# Altium schematic sheet SCH_WifiNode.SchDoc: TP Final - Reloj - WifiNode
size A4; Author: Luciano Lopez; CompanyName: UTN-FRBA; Revision: 1; SheetNumber: 9; SheetTotal: 10
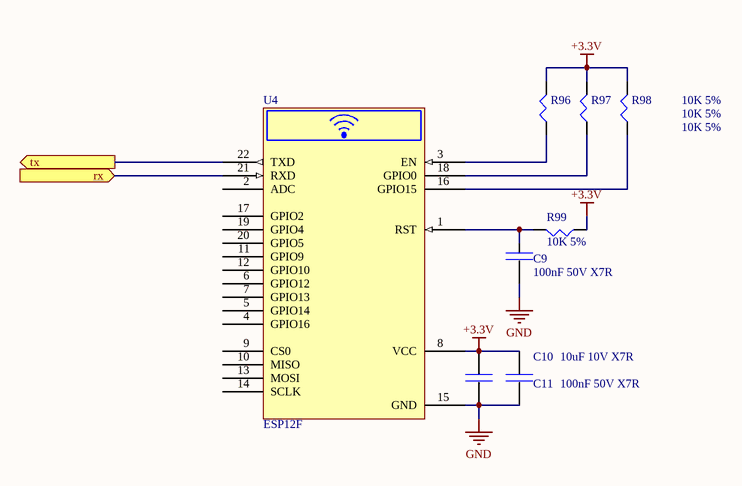
[diagram p0: SCH_WifiNode.SchDoc]

## Parts
C9  100nF 50V X7R  [C_0805]
C10  10uF 10V X7R  [C_0805]
C11  100nF 50V X7R  [C_0805]
R96  10K 5%  [R_0805]
R97  10K 5%  [R_0805]
R98  10K 5%  [R_0805]
R99  10K 5%  [R_0805]
U4  ESP12F  [ESP12F]

## Ports
rx (in), tx (out)

## Nets
+3.3V: C10.2 C11.2 R96.2 R97.2 R98.2 R99.1 U4.8(VCC)
GND: C9.1 C10.1 C11.1 U4.15(GND)
rx: U4.21(RXD) ; port rx
tx: U4.22(TXD) ; port tx
NetC9_2: C9.2 R99.2 U4.1(RST)
NetR96_1: R96.1 U4.3(EN)
NetR97_1: R97.1 U4.18(GPIO0)
NetR98_1: R98.1 U4.16(GPIO15)

Not connected (* = marked no-connect by the designer): U4 2(ADC) 4(GPIO16) 5(GPIO14) 6(GPIO12) 7(GPIO13) 9(CS0) 10(MISO) 11(GPIO9) 12(GPIO10) 13(MOSI) 14(SCLK) 17(GPIO2) 19(GPIO4) 20(GPIO5)

## Notes on the sheet
- Title:
- Size:
- Author:
- A4
- Sheet
- of
- Revision:
- File:
- Date:

## Library data of the parts
C9-C11 = CAPACITOR: 100nF x 50v
R96-R99 = Resistor
U4 = ESP12F Wifi Module: Wifi Module